# EAGLE design Pixel (EAGLE 6.0)
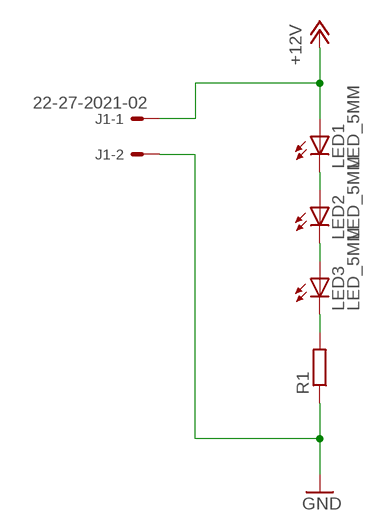
[diagram p0: schematic, sheet 1]

## Parts
J1  22-27-2021-02  [6410-02]
LED1  LED_5MM  [LED_5MM]
LED2  LED_5MM  [LED_5MM]
LED3  LED_5MM  [LED_5MM]
R1  RESISTOR-1/4W-SMD-1206  [R1206]

## Nets
+12V: J1.1 LED1.ANODE
GND: J1.2 R1.P$1
N$1: LED1.CATHODE LED2.ANODE
N$2: LED2.CATHODE LED3.ANODE
N$3: LED3.CATHODE R1.P$2

## Library data of the parts
J1 = con-molex:22-?-02: CONNECTOR wire to board 2.54 mm (.1 inch) pitch header; OC_FARNELL: unknown; OC_NEWARK: unknown
LED1-LED3 = icmi-custom-parts:LED: Standard LED 0.1 inch spacing
R1 = icmi-custom-parts:RESISTOR-1/4W

## Board
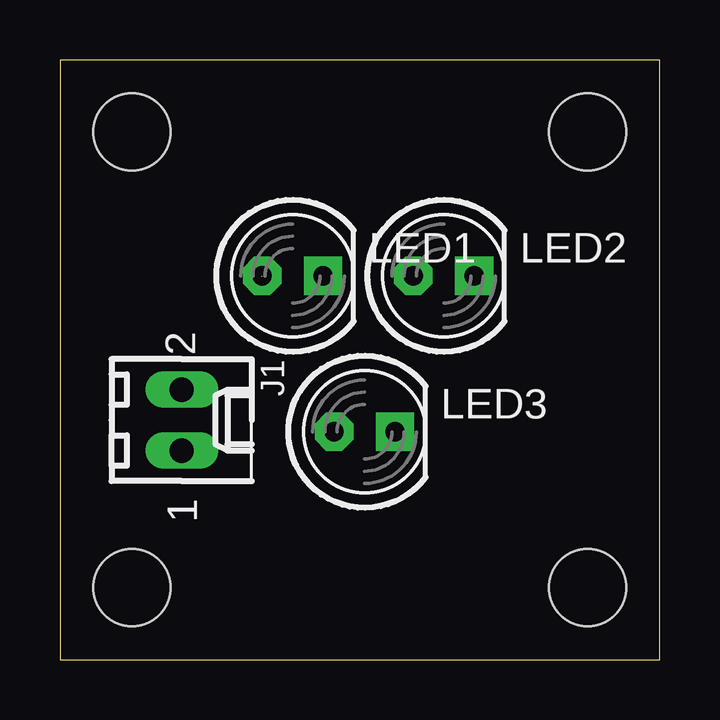
[diagram p1: board, top side]
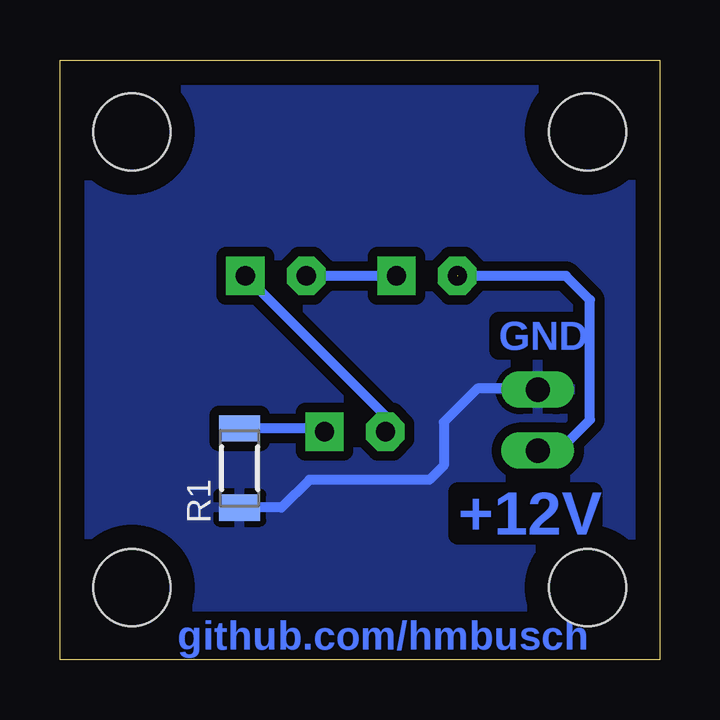
[diagram p2: board, bottom side, seen from below]

Size 25 x 25 mm. Coordinates in mm from the lower left corner, seen from the top.
Outline: 0,0 25,0 25,25 0,25 0,0
Copper layers (1*16): Top 0.035mm / dielectric 1.5mm / Bottom 0.035mm
Design rules: minimum track width 10mil, minimum drill 24mil, track to track 16mil, track to pad 16mil, pad to pad 16mil, via to via 8mil, smd to smd 8mil, copper to edge 40mil, drill to drill 8mil, minimum pad ring 10mil, minimum via ring 8mil, stop-mask expansion 4mil, vias tented up to drill 0mil, thermal gap 10mil
Holes 3.2 mm at 22,3 3,3 3,22 22,22

### Footprints (pad centres in the part's own frame; a part is rotated, then mirrored left to right if it is on the bottom)
6410-02 = drill 1.016 long: 1 1.27,0; 2 -1.27,0
LED_5MM = drill 0.8 pad 1.6 octagon: ANODE -1.27,0 | drill 0.8 pad 1.6 square: CATHODE 1.27,0
R1206 = smd 1.1 x 1.7: P$1 -1.65,0; P$2 1.65,0

### Placement (x,y rotation side)
J1  5.08,9.98 270 top
LED1  9.7,16 0 top
LED2  16,16 0 top
LED3  12.7,9.5 0 top
R1  17.5,7.99 90 bottom

### Tracks (layer width: path | path; a pad name or v marks a point on that pad's centre or on a via)
+12V  (1 unrouted)
  Bottom 0.406: J1.1 4.18,8.71 2.9,10 2.9,15 3.9,16 8.4,16
GND
  Bottom 0.406: J1.2 5.12,11.3 7.6,11.3 9,9.9 9,8.1 9.6,7.5 14.6,7.5 15.77,6.33 R1.P$1
  pour Bottom: 0,0 0,25 25,25 25,0
N$1
  Bottom 0.406: LED1.CATHODE LED2.ANODE
N$2
  Bottom 0.406: LED2.CATHODE 11.43,10.16 LED3.ANODE
N$3
  Bottom 0.406: LED3.CATHODE 14.11,9.63 R1.P$2

### Text on the board
Bottom: GND | +12V | github.com/hmbusch